# Altium project RFID_CC1101_433MHz.PrjPcb
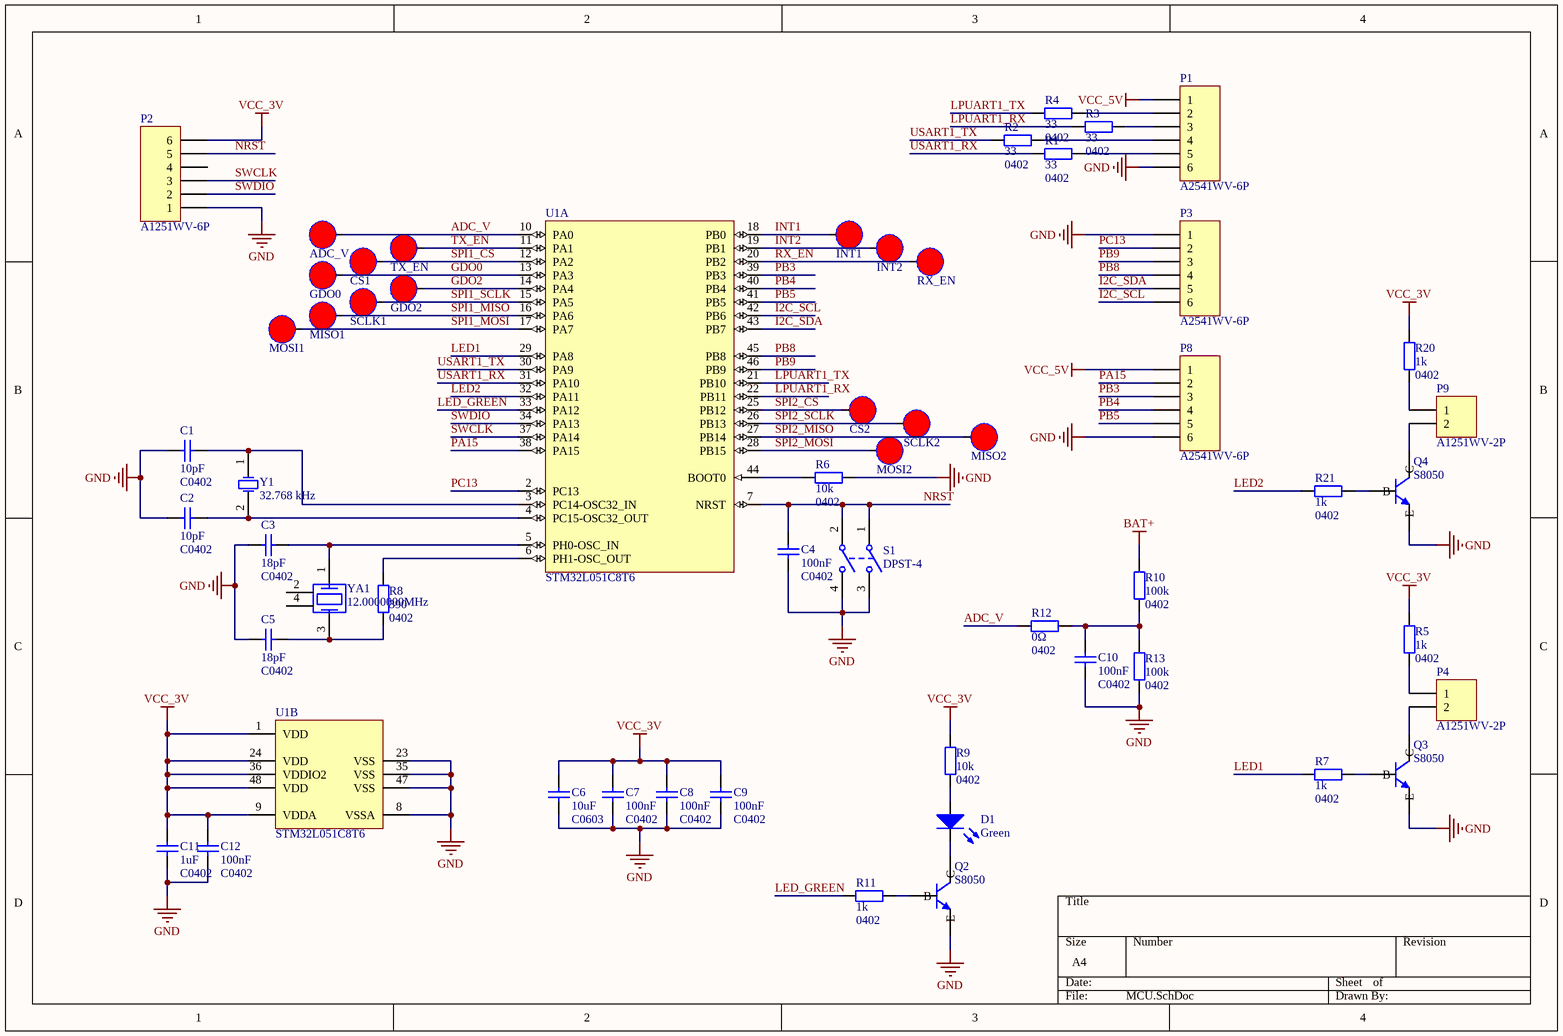
[diagram p0: MCU.SchDoc]
3 sheets, 90 parts. Net scope: global (net labels, ports and power ports of the same name join across sheets).
Board file: RFID_CC1101_433MHz.PcbDoc
Sheets:
  MCU.SchDoc
  MEMS&RF.SchDoc
  Power.SchDoc

## Sheet MCU.SchDoc
size A4

### Parts
ADC_V  TP-EMB-SMT-Single-20mil-1pin  [EMB-SMT-40MILX40MIL]  (value not drawn)
C1  10pF  PackageReference: C0402  [0402]
C2  10pF  PackageReference: C0402  [0402]
C3  18pF  PackageReference: C0402  [0402]
C4  100nF  PackageReference: C0402  [0402]
C5  18pF  PackageReference: C0402  [0402]
C6  10uF  PackageReference: C0603  [1608[0603]]
C7  100nF  PackageReference: C0402  [0402]
C8  100nF  PackageReference: C0402  [0402]
C9  100nF  PackageReference: C0402  [0402]
C10  100nF  PackageReference: C0402  [0402]
C11  1uF  PackageReference: C0402  [0402]
C12  100nF  PackageReference: C0402  [0402]
CS1  TP-EMB-SMT-Single-20mil-1pin  [EMB-SMT-40MILX40MIL]  (value not drawn)
CS2  TP-EMB-SMT-Single-20mil-1pin  [EMB-SMT-40MILX40MIL]  (value not drawn)
D1  Green  [0603/K]
GDO0  TP-EMB-SMT-Single-20mil-1pin  [EMB-SMT-40MILX40MIL]  (value not drawn)
GDO2  TP-EMB-SMT-Single-20mil-1pin  [EMB-SMT-40MILX40MIL]  (value not drawn)
INT1  TP-EMB-SMT-Single-20mil-1pin  [EMB-SMT-40MILX40MIL]  (value not drawn)
INT2  TP-EMB-SMT-Single-20mil-1pin  [EMB-SMT-40MILX40MIL]  (value not drawn)
MISO1  TP-EMB-SMT-Single-20mil-1pin  [EMB-SMT-40MILX40MIL]  (value not drawn)
MISO2  TP-EMB-SMT-Single-20mil-1pin  [EMB-SMT-40MILX40MIL]  (value not drawn)
MOSI1  TP-EMB-SMT-Single-20mil-1pin  [EMB-SMT-40MILX40MIL]  (value not drawn)
MOSI2  TP-EMB-SMT-Single-20mil-1pin  [EMB-SMT-40MILX40MIL]  (value not drawn)
P1  A2541WV-6P  [A2541WV-6P]
P2  A1251WV-6P  [A1251WV-6P-SWD]
P3  A2541WV-6P  [A2541WV-6P]
P4  A1251WV-2P  [A1251WV-2P]
P8  A2541WV-6P  [A2541WV-6P]
P9  A1251WV-2P  [A1251WV-2P]
Q2  S8050  [SOT-23B_N]
Q3  S8050  [SOT-23B_N]
Q4  S8050  [SOT-23B_N]
R1  33  PackageReference: 0402  [RESC1005X04N]
R2  33  PackageReference: 0402  [RESC1005X04N]
R3  33  PackageReference: 0402  [RESC1005X04N]
R4  33  PackageReference: 0402  [RESC1005X04N]
R5  1k  PackageReference: 0402  [RESC1005X04N]
R6  10k  PackageReference: 0402  [RESC1005X04N]
R7  1k  PackageReference: 0402  [RESC1005X04N]
R8  390  PackageReference: 0402  [RESC1005X04N]
R9  10k  PackageReference: 0402  [RESC1005X04N]
R10  100k  PackageReference: 0402  [RESC1005X04N]
R11  1k  PackageReference: 0402  [RESC1005X04N]
R12  0Ω  PackageReference: 0402  [RESC1005X04N]
R13  100k  PackageReference: 0402  [RESC1005X04N]
R20  1k  PackageReference: 0402  [RESC1005X04N]
R21  1k  PackageReference: 0402  [RESC1005X04N]
RX_EN  TP-EMB-SMT-Single-20mil-1pin  [EMB-SMT-40MILX40MIL]  (value not drawn)
S1  DPST-4  [DPST]
SCLK1  TP-EMB-SMT-Single-20mil-1pin  [EMB-SMT-40MILX40MIL]  (value not drawn)
SCLK2  TP-EMB-SMT-Single-20mil-1pin  [EMB-SMT-40MILX40MIL]  (value not drawn)
TX_EN  TP-EMB-SMT-Single-20mil-1pin  [EMB-SMT-40MILX40MIL]  (value not drawn)
U1  STM32L051C8T6  [STM-LQFP48_N]  (parts A,B of 2)
Y1  32.768 kHz  [XTAL-2012]
YA1  12.0000000MHz  [XTAL-SMT-4P]

### Nets
BAT+: R10.2
GND: C1.1 C2.1 C3.1 C4.1 C5.1 C6.1 C7.1 C8.1 C9.1 C10.1 C11.1 C12.1 P1.6 P2.1 P3.1 P8.6 Q2.E Q3.E Q4.E R6.2 R13.1 S1.3(NO1) S1.4(NO2) U1.8(VSSA) U1.23(VSS) U1.35(VSS) U1.47(VSS)
VCC_3V: C6.2 C7.2 C8.2 C9.2 C11.2 C12.2 P2.6 R5.2 R9.2 R20.2 U1.1(VDD) U1.9(VDDA) U1.24(VDD) U1.36(VDDIO2) U1.48(VDD)
VCC_5V: P1.1 P8.1
ADC_V: ADC_V.1 R12.1 U1.10(PA0)
GDO0: GDO0.1 U1.13(PA3)
GDO2: GDO2.1 U1.14(PA4)
I2C_SCL: P3.6 U1.42(PB6)
I2C_SDA: P3.5 U1.43(PB7)
INT1: INT1.1 U1.18(PB0)
INT2: INT2.1 U1.19(PB1)
LED1: R7.1 U1.29(PA8)
LED2: R21.1 U1.32(PA11)
LED_GREEN: R11.1 U1.33(PA12)
LPUART1_RX: R3.1 U1.22(PB11)
LPUART1_TX: R4.1 U1.21(PB10)
NRST: C4.2 P2.5 S1.1(COMMON1) S1.2(COMMON2) U1.7(NRST)
PA15: P8.2 U1.38(PA15)
PB3: P8.3 U1.39(PB3)
PB4: P8.4 U1.40(PB4)
PB5: P8.5 U1.41(PB5)
PB8: P3.4 U1.45(PB8)
PB9: P3.3 U1.46(PB9)
PC13: P3.2 U1.2(PC13)
RX_EN: RX_EN.1 U1.20(PB2)
SPI1_CS: CS1.1 U1.12(PA2)
SPI1_MISO: MISO1.1 U1.16(PA6)
SPI1_MOSI: MOSI1.1 U1.17(PA7)
SPI1_SCLK: SCLK1.1 U1.15(PA5)
SPI2_CS: CS2.1 U1.25(PB12)
SPI2_MISO: MISO2.1 U1.27(PB14)
SPI2_MOSI: MOSI2.1 U1.28(PB15)
SPI2_SCLK: SCLK2.1 U1.26(PB13)
SWCLK: P2.3 U1.37(PA14)
SWDIO: P2.2 U1.34(PA13)
TX_EN: TX_EN.1 U1.11(PA1)
USART1_RX: R1.1 U1.31(PA10)
USART1_TX: R2.2 U1.30(PA9)
NetC1_2: C1.2 U1.3(PC14-OSC32_IN) Y1.1(OSC1)
NetC2_2: C2.2 U1.4(PC15-OSC32_OUT) Y1.2(OSC2)
NetC3_2: C3.2 U1.5(PH0-OSC_IN) YA1.1
NetC5_2: C5.2 R8.1 YA1.3
NetC10_2: C10.2 R10.1 R12.2 R13.2
NetD1_A: D1.A R9.1
NetD1_K: D1.K Q2.C
NetP1_2: P1.2 R4.2
NetP1_3: P1.3 R3.2
NetP1_4: P1.4 R2.1
NetP1_5: P1.5 R1.2
NetP4_1: P4.1 R5.1
NetP4_2: P4.2 Q3.C
NetP9_1: P9.1 R20.1
NetP9_2: P9.2 Q4.C
NetQ2_B: Q2.B R11.2
NetQ3_B: Q3.B R7.2
NetQ4_B: Q4.B R21.2
NetR6_1: R6.1 U1.44(BOOT0)
NetR8_2: R8.2 U1.6(PH1-OSC_OUT)

Not connected (* = marked no-connect by the designer): P2 4; YA1 2 4

### Library data of the parts
ADC_V CS1 CS2 GDO0 GDO2 INT1 INT2 MISO1 MISO2 MOSI1 MOSI2 RX_EN SCLK1 SCLK2 TX_EN = TP-EMB-SMT-Single-20mil-1pin: Test Point Designed for holding a standard probe lead
C1 C2 = CC0402FRNPO9BN100: Capacitor (0402,NPO,10pF,DC 50V,±1%) YAGEO; Published: 8-Jun-2000; LatestRevisionDate: 29-May-2009; LatestRevisionNote: IPC-7351 Footprint Added.; Publisher: Altium Limited; PackageDescription: Chip Capacitor; Value: 10pF
C3 C5 = CC0402FRNPO9BN180: Capacitor (0402,NPO,18pF,DC 50V,±1%) YAGEO; Published: 8-Jun-2000; LatestRevisionDate: 29-May-2009; LatestRevisionNote: IPC-7351 Footprint Added.; Publisher: Altium Limited; PackageDescription: Chip Capacitor; Value: 18pF
C4 C7-C10 C12 = GRM155R71H104KE14: Capacitor (0402,X7R,100nF,DC 50V,±10%) Murata; Published: 8-Jun-2000; LatestRevisionDate: 29-May-2009; LatestRevisionNote: IPC-7351 Footprint Added.; Publisher: Altium Limited; PackageDescription: Chip Capacitor; Value: 100nF
C6 = GRM188R61E106MA73: Capacitor(0603,X5R(EIA),10uF,DC 25V,+/-20 %) muRata; Published: 8-Jun-2000; LatestRevisionDate: 29-May-2009; LatestRevisionNote: IPC-7351 Footprint Added.; Publisher: Altium Limited; PackageDescription: Chip Capacitor; Value: 10uF
C11 = GRM155R61E105KE11: Capacitor (0402,X5R,1uF,DC 25V,±10%) Murata; Published: 8-Jun-2000; LatestRevisionDate: 29-May-2009; LatestRevisionNote: IPC-7351 Footprint Added.; Publisher: Altium Limited; PackageDescription: Chip Capacitor; Value: 1uF
D1 = XL-1608SYGC: Standard 0603 SMD LED, Green, 1.6-2.2V; Published: 8-Jun-2000; LatestRevisionDate: 17-Jul-2002; LatestRevisionNote: Re-released for DXP Platform.; PackageVersion: Feb-2002; PackageReference: 0603; Publisher: Altium Limited; PackageDescription: SM LED; 2 Flat Leads; Valid: Green
P1 P3 P8 = A2541WV-6P: Header, 6-Pin, 针座-2.54mm间距，180度，DIP排针; LatestRevisionDate: 17-Jul-2002; LatestRevisionNote: Re-released for DXP Platform.; Publisher: Altium Limited
P2 = A1251WV-6P: Header, 6-Pin, 1.25mm PITCH, 180° WAFER; LatestRevisionDate: 17-Jul-2002; LatestRevisionNote: Re-released for DXP Platform.; Publisher: Altium Limited
P4 P9 = A1251WV-2P: Header, 2-Pin, 1.25mm PITCH, 180° WAFER; LatestRevisionDate: 17-Jul-2002; LatestRevisionNote: Re-released for DXP Platform.; Publisher: Altium Limited
Q2-Q4 = S8050: NPN General Purpose Amplifier, -55 to +150°C; Manufacturer: 扬州扬杰电子科技股份有限公司; VCBO(V): 40; VCEO(V): 25; VEBO(V): 5; IC(mA): 500; PC(mW): 300; Package: SOT-23
R1-R4 = RC0402FR-0733RL: Resistor 0402(1005) 33Ω ±1%; PackageDescription: Chip Resistor, 2-Leads, Body 1.00x0.50mm, IPC Medium Density; Value: 33
R5 R7 R11 R20 R21 = RC0402FR-071KL: Resistor 0402(1005) 1kΩ ±1%; PackageDescription: Chip Resistor, 2-Leads, Body 1.00x0.50mm, IPC Medium Density; Value: 1k
R6 R9 = RC0402FR-0710KL: Resistor 0402(1005) 10kΩ ±1%; PackageDescription: Chip Resistor, 2-Leads, Body 1.00x0.50mm, IPC Medium Density; Value: 10k
R8 = RC0402FR-07390RL: Resistor 0402(1005) 390Ω ±1%; PackageDescription: Chip Resistor, 2-Leads, Body 1.00x0.50mm, IPC Medium Density; Value: 390
R10 R13 = RC0402FR-07100KL: Resistor 0402(1005) 100kΩ ±1%; PackageDescription: Chip Resistor, 2-Leads, Body 1.00x0.50mm, IPC Medium Density; Value: 100k
R12 = RC0402JR: Resistor 0402(1005) 0Ω; PackageDescription: Chip Resistor, 2-Leads, Body 1.00x0.50mm, IPC Medium Density; Value: 0Ω
S1 = CX-G001: 5.2*5.2轻触开关; Published: 24-Mar-1999; LatestRevisionDate: 17-Jul-2002; LatestRevisionNote: Re-released for DXP Platform.; PackageReference: DPST-4; Publisher: Altium Limited; PackageDescription: Switch; 4 Leads
U1 = STM32L051C8T6: Access line ultra-low-power 32-bit MCU Arm®-based Cortex®-M0+, 64 KB Flash, 8 KB SRAM,2 KB EEPROM, 38 fast I/Os, 48-pin LQFP, -40 to 125 degC, Tray; A/D Converter: 2x12-bit; Core: ARM Cortex-M0+; FLASH Size (Prog) (kB): 64; I/Os (High Current): 37; Internal RAM Size (kB): 20; Operating Frequency(F) (Processor speed) (MHz): 32; Supply Voltage(Vcc) min (V): 2; DatasheetVersion: Rev. 16; PackageVersion: Rev. 6, 06/2013; PackageReference: LQFP48; PackageDescription: 48-Pin Low Profile Quad Flat Package, 7 x 7 mm Body, 0.5 mm Pitch; Supplier 1: Digi-Key; Supplier Part Number 1: 497-11517-ND; Supplier 2: Farnell; Supplier Part Number 2: 1899017; Supplier 3: Newark; Supplier Part Number 3: 72T2644; Supplier 4: Mouser; Supplier Part Number 4: 511-STM32L051C8T6; Packing: Tray; Mounting Technology: Surface Mount; PartNumber: STM32L051C8T6; ComponentLink1Description: Manufacturer URL; ComponentLink1URL: http://www.st.com/web/en/home.html; ComponentLink2Description: Datasheet; ComponentLink2URL: http://www.st.com/st-web-ui/static/active/en/resource/technical/document/datasheet/CD00161566.pdf; ComponentLink3Description: Package Specification; ComponentLink3URL: http://www.st.com/st-web-ui/static/active/en/resource/technical/document/datasheet/DM00058181.pdf
Y1 = 7RC32768F12UC: Crystal Oscillator, 2.0×1.2×0.6 mm, 2 Pins, 32.768kHz, -40°C~+85°C, 12pF; Manufacturer: SJK; Package size (L×W×H): 2.0×1.2×0.60 mm; Frequency Tolerance: ±5ppm, ±10ppm, ±20ppm (max.) at 25°C; Frequency range: 32.768 kHz; Operating Temperature Range: Re-released for DXP Platform.; PackageReference: -40°C~+85°C; Load Capacitance: 12pF
YA1 = 7U12000E12UCG: Crystal Oscillator, 3.2×2.5×0.70 mm, 4 Pins, 12.000MHz, -40°C~+85°C, 12pF, ±10PPM; Manufacturer: SJK; Mode: AT/Fundamental; Frequency Tolerance: ±10ppm max; Load Capacitance(CL): 12.0pF; Shunt Capacitance: 3.0 pF Max; Frequency Range: 12.0000000MHz; Operating Temperature Range: -40 °C to +85°C; Package size (L×W×H): 3.2×2.5×0.70 mm

## Sheet MEMS&RF.SchDoc
size A4
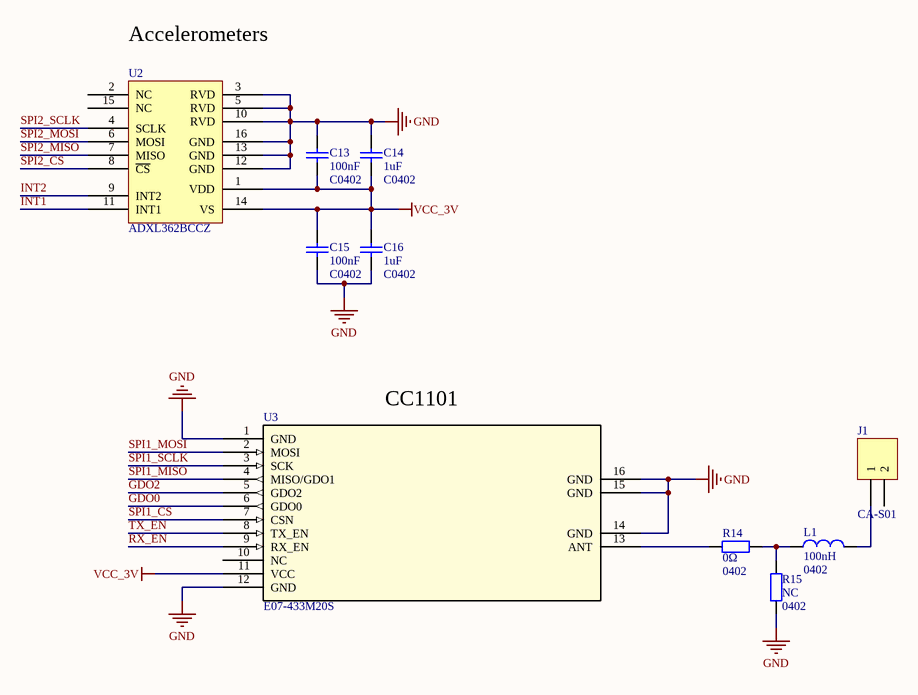
[diagram p1: MEMS&RF.SchDoc]

### Parts
C13  100nF  PackageReference: C0402  [0402]
C14  1uF  PackageReference: C0402  [0402]
C15  100nF  PackageReference: C0402  [0402]
C16  1uF  PackageReference: C0402  [0402]
J1  CA-S01  [CA-S01]
L1  100nH  [0402]
R14  0Ω  PackageReference: 0402  [RESC1005X04N]
R15  NC  PackageReference: 0402  [RESC1005X04N]
U2  ADXL362BCCZ  [LGA_CC-16-4]
U3  E07-433M20S  [PE07-433M20S]

### Nets
GND: C13.2 C14.2 C15.2 C16.1 R15.1 U2.3(RVD) U2.5(RVD) U2.10(RVD) U2.12(GND) U2.13(GND) U2.16(GND) U3.1(GND) U3.12(GND) U3.14(GND) U3.15(GND) U3.16(GND)
VCC_3V: C13.1 C14.1 C15.1 C16.2 U2.1(VDD) U2.14(VS) U3.11(VCC)
GDO0: U3.6(GDO0)
GDO2: U3.5(GDO2)
INT1: U2.11(INT1)
INT2: U2.9(INT2)
RX_EN: U3.9(RX_EN)
SPI1_CS: U3.7(CSN)
SPI1_MISO: U3.4(MISO/GDO1)
SPI1_MOSI: U3.2(MOSI)
SPI1_SCLK: U3.3(SCK)
SPI2_CS: U2.8(~{CS})
SPI2_MISO: U2.7(MISO)
SPI2_MOSI: U2.6(MOSI)
SPI2_SCLK: U2.4(SCLK)
TX_EN: U3.8(TX_EN)
NetJ1_1: J1.1 L1.2
NetL1_1: L1.1 R14.2 R15.2
NetR14_1: R14.1 U3.13(ANT)

Not connected (* = marked no-connect by the designer): J1 2; U2 2(NC) 15(NC); U3 10(NC)

### Notes on the sheet
- (near U2) Accelerometers
- (near U3) CC1101

### Library data of the parts
C13 C15 = GRM155R71H104KE14: as C4 on sheet MCU; Published: 8-Jun-2000; LatestRevisionDate: 29-May-2009; LatestRevisionNote: IPC-7351 Footprint Added.; Publisher: Altium Limited; PackageDescription: Chip Capacitor; Value: 100nF
C14 C16 = GRM155R61E105KE11: as C11 on sheet MCU; Published: 8-Jun-2000; LatestRevisionDate: 29-May-2009; LatestRevisionNote: IPC-7351 Footprint Added.; Publisher: Altium Limited; PackageDescription: Chip Capacitor; Value: 1uF
J1 = CA-S01: CrossAir Antenna，广州寒武纪电子科技有限公司; LatestRevisionDate: 17-Jul-2002; LatestRevisionNote: Re-released for DXP Platform.; Publisher: Altium Limited
L1 = LQW15ANR10J00: Inductor, 100n, 0402, ±5%, wire-wound type Murata; Published: 8-Jun-2000; LatestRevisionDate: 29-May-2009; LatestRevisionNote: IPC-7351 Footprint Added.; Publisher: Altium Limited; PackageDescription: Inductor; Value: 100nH; PackageReference: 0402
R14 R15 = RC0402JR: Resistor 0402(1005) 0Ω; PackageDescription: Chip Resistor, 2-Leads, Body 1.00x0.50mm, IPC Medium Density
  R14: Value: 0Ω
  R15: Value: NC
U2 = ADXL362BCCZ: ADXL362, LGA, CC-16-4.
U3 = E07-433M20S: E07-433M20S是基于美国原装进口CC1101由成都亿佰特设计生产的大功率CC1101无线模块，默认发射功率为100mW、内置PA的模块，做到了功耗与性能的平衡。SPI接口，收发一体，可以工作在433MHz主流ISM频段，支持开发低功耗，目前已经多种场景中广泛应用; Isupply(uA): 2; Vin(V): 2.1-3.6; Iout(max)(mA): 100; frequency(MHz): 433

## Sheet Power.SchDoc
size A4
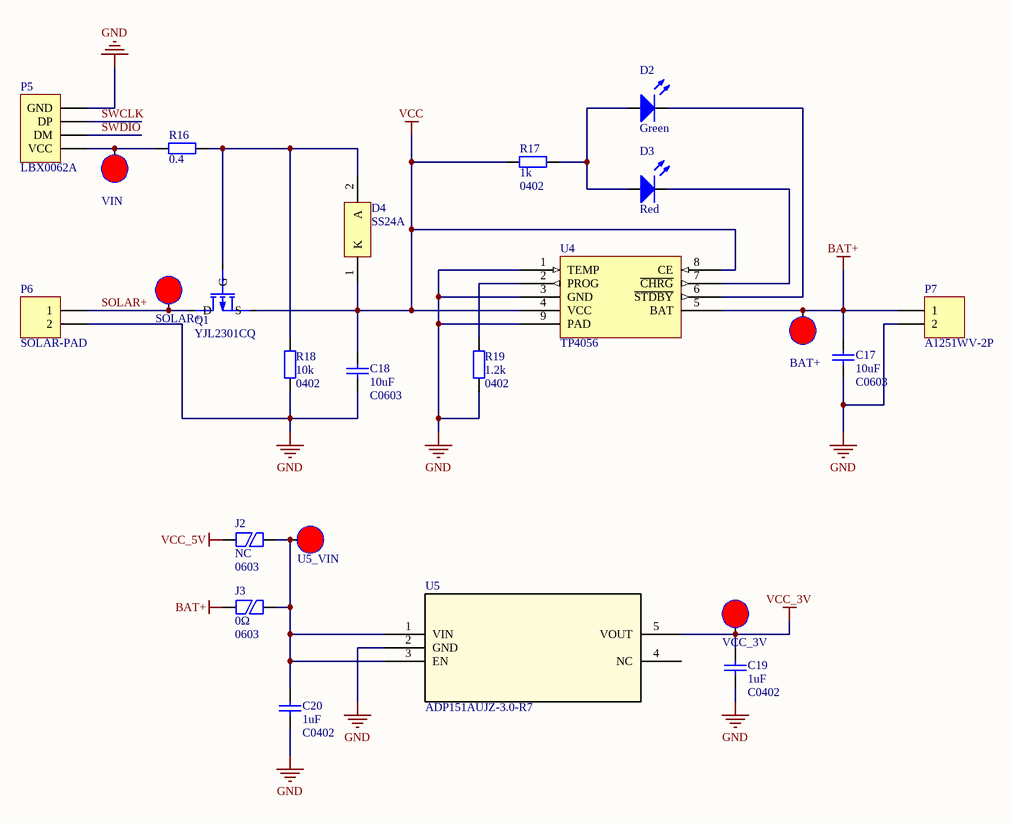
[diagram p2: Power.SchDoc]

### Parts
BAT+  TP-EMB-SMT-Single-20mil-1pin  [EMB-SMT-40MILX40MIL]  (value not drawn)
C17  10uF  PackageReference: C0603  [1608[0603]]
C18  10uF  PackageReference: C0603  [1608[0603]]
C19  1uF  PackageReference: C0402  [0402]
C20  1uF  PackageReference: C0402  [0402]
D2  Green  [0603/K]
D3  Red  [0603/K]
D4  SS24A  [ONSC-SMA-2-403D-02_V]
J2  NC  PackageReference: 0603  [1608[0603] - jumper]
J3  0Ω  PackageReference: 0603  [1608[0603] - jumper]
P5  LBX0062A  [LBX0062A]
P6  SOLAR-PAD  [SOLAR-PAD]
P7  A1251WV-2P  [A1251WV-2P]
Q1  YJL2301CQ  [SOT95P237X112-3N]
R16  0.4  [RESC3216X07N]
R17  1k  PackageReference: 0402  [RESC1005X04N]
R18  10k  PackageReference: 0402  [RESC1005X04N]
R19  1.2k  PackageReference: 0402  [RESC1005X04N]
SOLAR+  TP-EMB-SMT-Single-20mil-1pin  [EMB-SMT-40MILX40MIL]  (value not drawn)
U4  TP4056  [ESOP-9N]
U5  ADP151AUJZ-3.0-R7  [UJ_5]
U5_VIN  TP-EMB-SMT-Single-20mil-1pin  [EMB-SMT-40MILX40MIL]  (value not drawn)
VCC_3V  TP-EMB-SMT-Single-20mil-1pin  [EMB-SMT-40MILX40MIL]  (value not drawn)
VIN  TP-EMB-SMT-Single-20mil-1pin  [EMB-SMT-40MILX40MIL]  (value not drawn)

### Nets
BAT+: BAT+.1 C17.2 J3.1 P7.1 U4.5(BAT)
GND: C17.1 C18.2 C19.1 C20.1 P5.4(GND) P6.2 P7.2 R18.1 R19.1 U4.1(TEMP) U4.3(GND) U4.9(PAD) U5.2(GND)
VCC: C18.1 D4.1(K) Q1.2(S) R17.1 U4.4(VCC) U4.8(CE)
VCC_3V: C19.2 U5.5(VOUT) VCC_3V.1
VCC_5V: J2.1
SOLAR+: P6.1 Q1.3(D) SOLAR+.1
SWCLK: P5.3(DP)
SWDIO: P5.2(DM)
NetC20_2: C20.2 J2.2 J3.2 U5.1(VIN) U5.3(EN) U5_VIN.1
NetD2_A: D2.A D3.A R17.2
NetD2_K: D2.K U4.6(~{STDBY})
NetD3_K: D3.K U4.7(~{CHRG})
NetD4_2: D4.2(A) Q1.1(G) R16.2 R18.2
NetP5_1: P5.1(VCC) R16.1 VIN.1
NetR19_2: R19.2 U4.2(PROG)

Not connected (* = marked no-connect by the designer): U5 4(NC)

### Library data of the parts
BAT+ SOLAR+ U5_VIN VCC_3V VIN = TP-EMB-SMT-Single-20mil-1pin: as ADC_V on sheet MCU
C17 C18 = GRM188R61E106MA73: as C6 on sheet MCU; Published: 8-Jun-2000; LatestRevisionDate: 29-May-2009; LatestRevisionNote: IPC-7351 Footprint Added.; Publisher: Altium Limited; PackageDescription: Chip Capacitor; Value: 10uF
C19 C20 = GRM155R61E105KE11: as C11 on sheet MCU; Published: 8-Jun-2000; LatestRevisionDate: 29-May-2009; LatestRevisionNote: IPC-7351 Footprint Added.; Publisher: Altium Limited; PackageDescription: Chip Capacitor; Value: 1uF
D2 = XL-1608SYGC: Standard 0603 SMD LED, Green, 1.6-2.2V; Published: 8-Jun-2000; LatestRevisionDate: 17-Jul-2002; LatestRevisionNote: Re-released for DXP Platform.; PackageVersion: Feb-2002; PackageReference: 0603; Publisher: Altium Limited; PackageDescription: SM LED; 2 Flat Leads; Valid: Green
D3 = XL-1608SURC: Standard 0603 SMD LED, Red, 1.6-2.2V; Published: 8-Jun-2000; LatestRevisionDate: 17-Jul-2002; LatestRevisionNote: Re-released for DXP Platform.; PackageVersion: Feb-2002; PackageReference: 0603; Publisher: Altium Limited; PackageDescription: SM LED; 2 Flat Leads; Valid: Red
D4 = SS24A: Surface Mount Schottky Rectifier, 2-Pin SMA, VRRM=40V , VF=0.5V at IF=2.0A, -55~+125°C; Manufacturer: 扬州扬杰电子科技股份有限公司; Configuration: Single; IFSM Max (A): 50; Packing: Tape and Reel; VRRM(V): 40; PackageReference: DO-214AC (SMA); PackageDescription: 2-Pin Small Molded Package, J-Bend Lead, Body 2.605 x 4.315 mm; RoHS: TRUE; Mounting Technology: Surface Mount; PartNumber: SS24A; ComponentLink1Description: Manufacturer URL; ComponentLink1URL: https://www.vishay.com; ComponentLink2Description: Datasheet; ComponentLink2URL: https://www.vishay.com/product?docid=89008; ComponentLink3Description: Package Specification; ComponentLink3URL: http://www.vishay.com/docs/88869/packaging.pdf
J2 J3 = RC0603JR-JUMP: Resistor 0603(1608) 0Ω jumper; PackageDescription: Chip Resistor, 2-Leads, Body 1.60x0.80mm, IPC Medium Density
  J2: Value: NC
  J3: Value: 0Ω
P5 = LBX0062A: PogoPinLBX0062A, 4-Pin; LatestRevisionDate: 17-Jul-2002; LatestRevisionNote: Re-released for DXP Platform.; Publisher: Altium Limited
P6 = SOLAR-PAD: Header, 2-Pin; LatestRevisionDate: 17-Jul-2002; LatestRevisionNote: Re-released for DXP Platform.; Publisher: Altium Limited
P7 = A1251WV-2P: Header, 2-Pin, 1.25mm PITCH, 180° WAFER; LatestRevisionDate: 17-Jul-2002; LatestRevisionNote: Re-released for DXP Platform.; Publisher: Altium Limited
Q1 = YJL2301CQ: P-Channel Enhancement Mode Field Effect Transistor,VDS=-20V,VGS=±10V,ID=-3.4A,VGS(th)Min=-0.4V,SOT-23; Published: 8-Jun-2000; LatestRevisionDate: 17-Jul-2002; LatestRevisionNote: Re-released for DXP Platform.; PackageVersion: 1995/1996; PackageReference: SOT23; Publisher: Altium Limited; PackageDescription: SOT23, 3-Leads, Body 2.92x2.37mm, Pitch 0.95mm, IPC Medium Density
R16 = PE1206FRF470R4L: Resistor 1206(3216) 0.4Ω ±1% 1W AUTOMOTIVE GRADEPE_L series; PackageReference: 1206; PackageDescription: Chip Resistor, 2-Leads, Body 3.20x1.60mm, IPC Medium Density; Value: 0.4
R17 = RC0402FR-071KL: Resistor 0402(1005) 1kΩ ±1%; PackageDescription: Chip Resistor, 2-Leads, Body 1.00x0.50mm, IPC Medium Density; Value: 1k
R18 = RC0402FR-0710KL: Resistor 0402(1005) 10kΩ ±1%; PackageDescription: Chip Resistor, 2-Leads, Body 1.00x0.50mm, IPC Medium Density; Value: 10k
R19 = RC0402FR-071K2L: Resistor 0402(1005) 1.2kΩ ±1%; PackageDescription: Chip Resistor, 2-Leads, Body 1.00x0.50mm, IPC Medium Density; Value: 1.2k
U4 = TP4056: 1A线性锂离子电池充电器
U5 = ADP151: The ADP151 is an ultralow noise, low dropout (LDO) linear regulator that operates from 2.2 V to 5.5 V and provides up to 200 mA of output current.; Dropout Voltage(mV): 140; RMS Niose(uV): 9; Isupply(uA): 10; Vin(V): 2.2-5.5; Iout(max)(mA): 200; Vout(V): 1.1, 1.2, 1.5, 1.8, 2.1, 2.5, 2.6, 2.75, 2.8, 2.85, 3.0, 3.3

## Nets that join several sheets
BAT+: MCU (R10.2), Power (5 pins)
GND: MCU (27 pins), MEMS&RF (16 pins), Power (13 pins)
VCC_3V: MCU (15 pins), MEMS&RF (7 pins), Power (C19.2 U5.5 VCC_3V.1)
VCC_5V: MCU (P1.1 P8.1), Power (J2.1)
GDO0: MCU (GDO0.1 U1.13), MEMS&RF (U3.6)
GDO2: MCU (GDO2.1 U1.14), MEMS&RF (U3.5)
INT1: MCU (INT1.1 U1.18), MEMS&RF (U2.11)
INT2: MCU (INT2.1 U1.19), MEMS&RF (U2.9)
RX_EN: MCU (RX_EN.1 U1.20), MEMS&RF (U3.9)
SPI1_CS: MCU (CS1.1 U1.12), MEMS&RF (U3.7)
SPI1_MISO: MCU (MISO1.1 U1.16), MEMS&RF (U3.4)
SPI1_MOSI: MCU (MOSI1.1 U1.17), MEMS&RF (U3.2)
SPI1_SCLK: MCU (SCLK1.1 U1.15), MEMS&RF (U3.3)
SPI2_CS: MCU (CS2.1 U1.25), MEMS&RF (U2.8)
SPI2_MISO: MCU (MISO2.1 U1.27), MEMS&RF (U2.7)
SPI2_MOSI: MCU (MOSI2.1 U1.28), MEMS&RF (U2.6)
SPI2_SCLK: MCU (SCLK2.1 U1.26), MEMS&RF (U2.4)
SWCLK: MCU (P2.3 U1.37), Power (P5.3)
SWDIO: MCU (P2.2 U1.34), Power (P5.2)
TX_EN: MCU (TX_EN.1 U1.11), MEMS&RF (U3.8)